# EAGLE design esc (EAGLE 9.5.2)

## Sheet 1 of 2: microcontroller
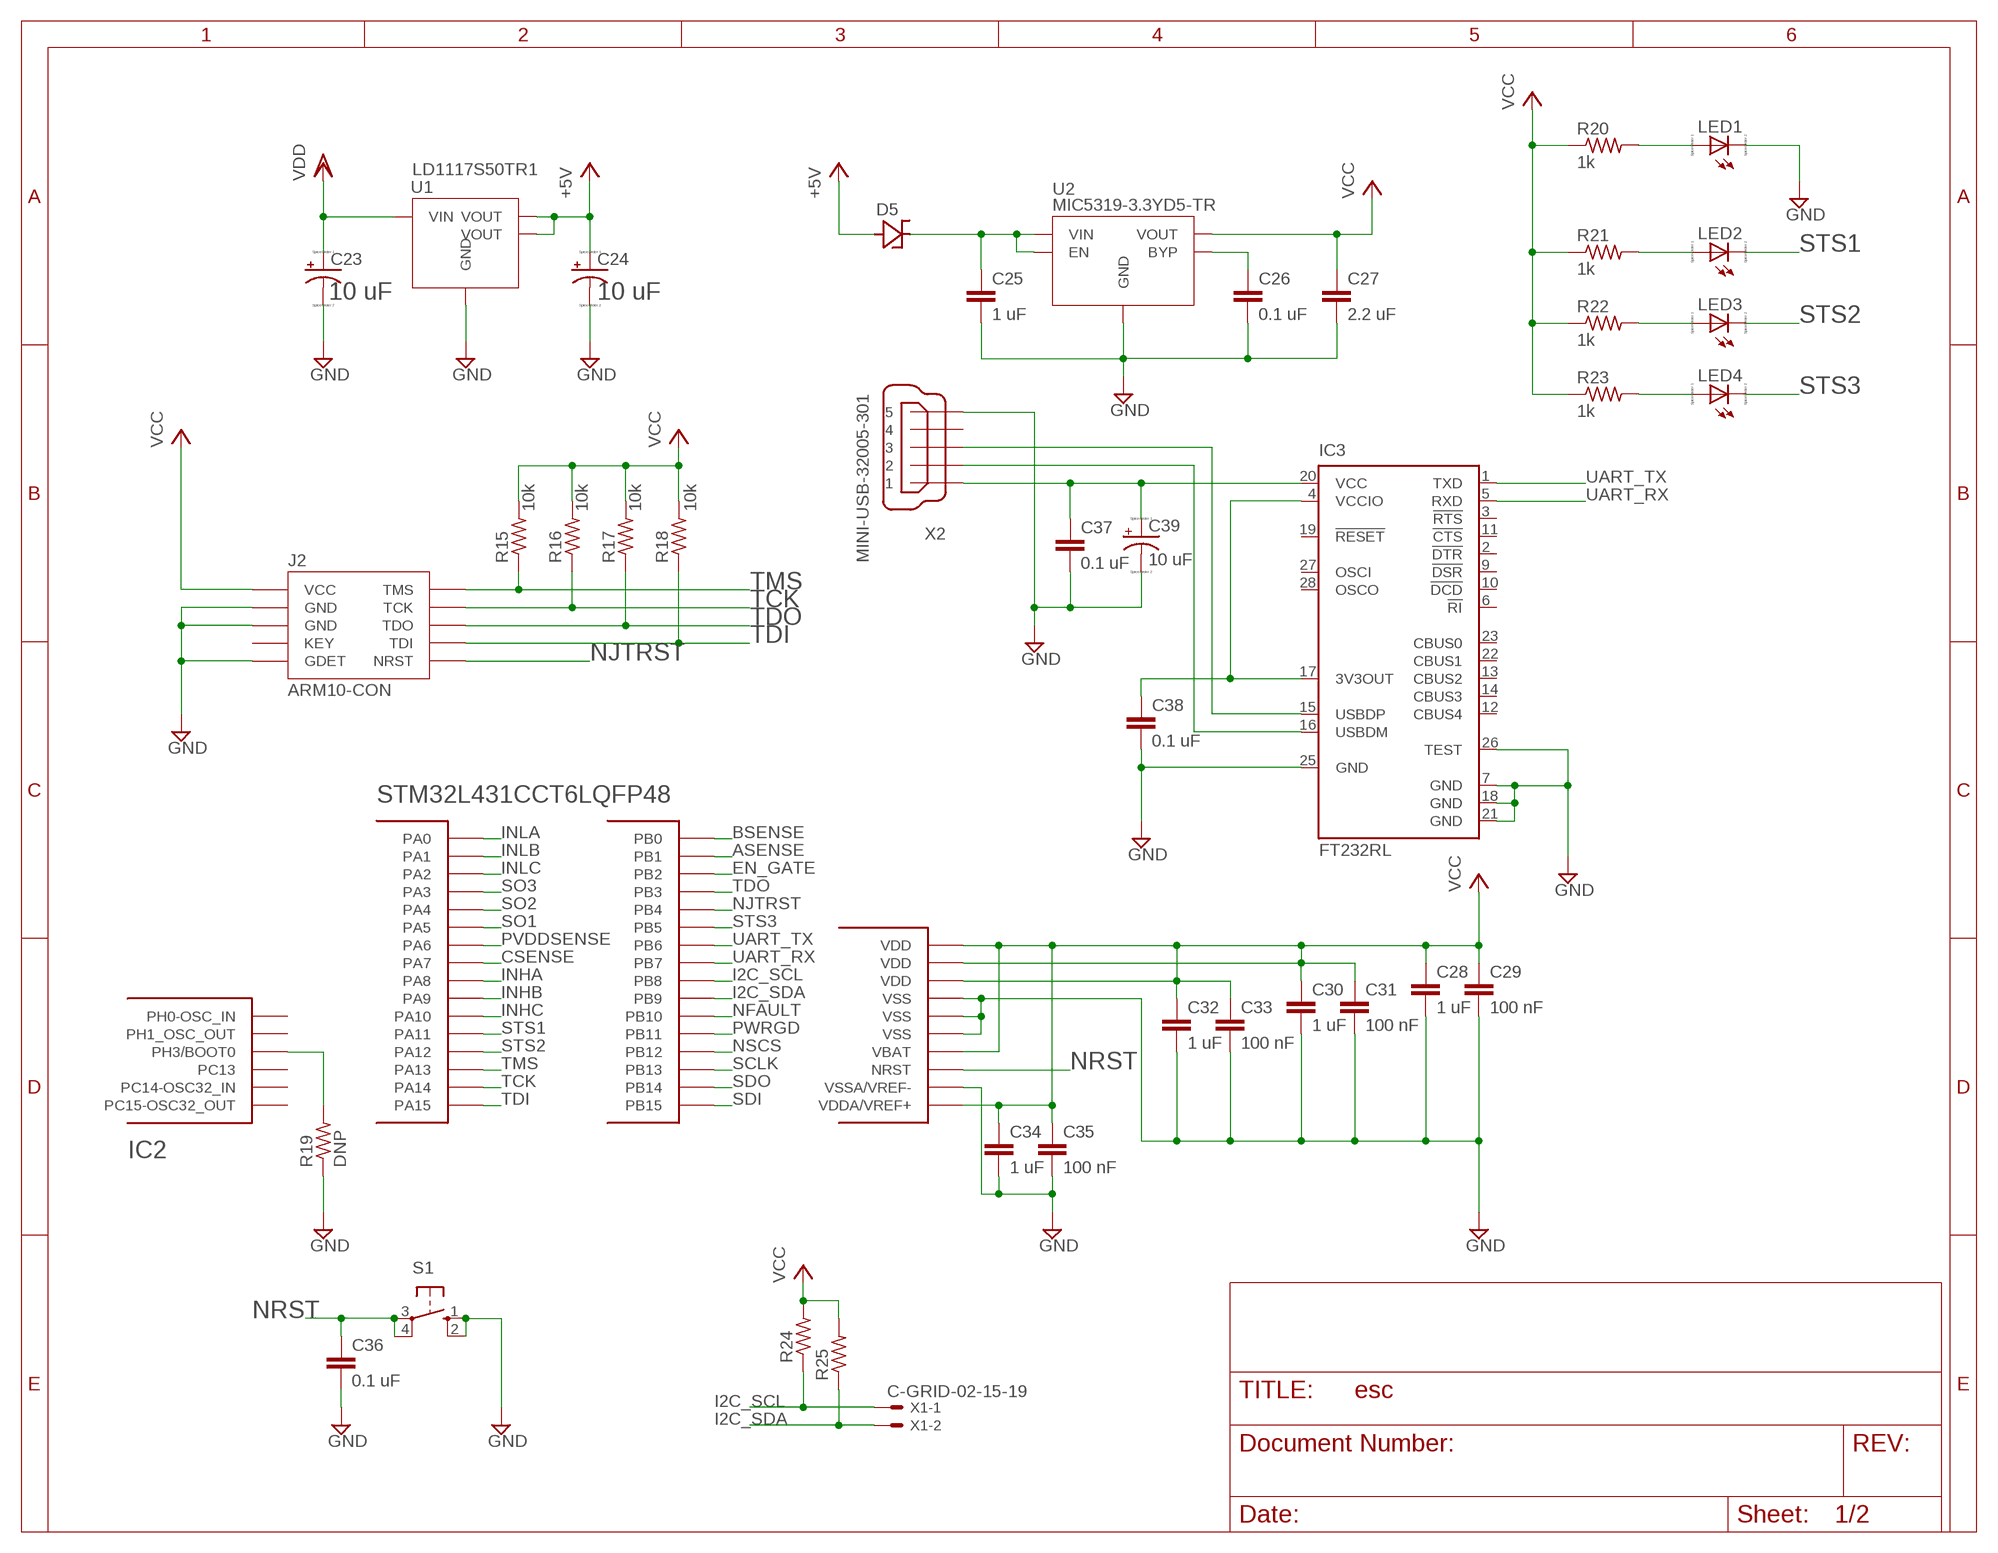
[diagram p0: schematic, sheet 1]

### Parts
C23  10 uF  CAPACITOR4.3X4.3  [CAPAE430X580N]
C24  CAPACITOR4.3X4.3  [CAPAE430X580N]
C25  1 uF  C-EUC0603  [C0603]
C26  0.1 uF  C-EUC0603  [C0603]
C27  2.2 uF  C-EUC0603  [C0603]
C28  1 uF  C-EUC0603  [C0603]
C29  100 nF  C-EUC0603  [C0603]
C30  1 uF  C-EUC0603  [C0603]
C31  100 nF  C-EUC0603  [C0603]
C32  1 uF  C-EUC0603  [C0603]
C33  100 nF  C-EUC0603  [C0603]
C34  1 uF  C-EUC0603  [C0603]
C35  100 nF  C-EUC0603  [C0603]
C36  0.1 uF  C-EUC0603  [C0603]
C37  0.1 uF  C-EUC0603  [C0603]
C38  0.1 uF  C-EUC0603  [C0603]
C39  10 uF  CPOL-USCT3216  [CT3216]
D5  STPS2L30ASMA  [DIOM5025X245N]
IC2  STM32L431CCT6LQFP48  [QFP50P900X900X160-48N]
IC3  FT232RL  [SSOP28]
J2  ARM10-CON  [10-PIN-1.27-PITCH]
LED1  LED_ESML0603  [LED_SML0603]
LED2  LED_ESML0603  [LED_SML0603]
LED3  LED_ESML0603  [LED_SML0603]
LED4  LED_ESML0603  [LED_SML0603]
R15  10k  R-US_R0603  [R0603]
R16  10k  R-US_R0603  [R0603]
R17  10k  R-US_R0603  [R0603]
R18  10k  R-US_R0603  [R0603]
R19  DNP  R-US_R0603  [R0603]
R20  1k  R-US_R0603  [R0603]
R21  1k  R-US_R0603  [R0603]
R22  1k  R-US_R0603  [R0603]
R23  1k  R-US_R0603  [R0603]
R24  R-US_R0603  [R0603]
R25  R-US_R0603  [R0603]
S1  10-XX  [B3F-10XX]
U1  LD1117S50TR1  [SOT230P700X180-4N]
U2  MIC5319-3.3YD5-TR  [SOT95P290X110-5N]
X1  C-GRID-02-15-19  [15-91-02]
X2  MINI-USB-32005-301  [32005-301]

### Nets
+5V: C24.1(+) D5.2(A) U1.2(VOUT) U1.4(VOUT)
ASENSE: IC2.19(PB1) ; also sheet 2
BSENSE: IC2.18(PB0) ; also sheet 2
CSENSE: IC2.17(PA7) ; also sheet 2
EN_GATE: IC2.20(PB2) ; also sheet 2
GND: C23.2(-) C24.2(-) C25.2 C26.2 C27.2 C28.2 C29.2 C30.2 C31.2 C32.2 C33.2 C34.2 C35.2 C36.2 C37.2 C38.2 C39.+(-) IC2.8(VSSA/VREF-) IC2.23(VSS) IC2.35(VSS) IC2.47(VSS) IC3.7(GND) IC3.18(GND) IC3.21(GND) IC3.25(GND) IC3.26(TEST) J2.3(GND) J2.5(GND) J2.9(GDET) LED1.C R19.1 S1.1(S) S1.2(S1) U1.1(GND) U2.2(GND) X2.5 ; also sheet 2
I2C_SCL: IC2.45(PB8) R24.1 X1.1
I2C_SDA: IC2.46(PB9) R25.1 X1.2
INHA: IC2.29(PA8) ; also sheet 2
INHB: IC2.30(PA9) ; also sheet 2
INHC: IC2.31(PA10) ; also sheet 2
INLA: IC2.10(PA0) ; also sheet 2
INLB: IC2.11(PA1) ; also sheet 2
INLC: IC2.12(PA2) ; also sheet 2
N$11: C25.1 D5.1(C) U2.1(VIN) U2.3(EN)
N$12: C26.1 U2.4(BYP)
N$13: IC2.44(PH3/BOOT0) R19.2
N$14: LED1.A R20.2
N$15: C37.1 C39.-(+) IC3.20(VCC) X2.1
N$16: LED2.A R21.2
N$17: LED3.A R22.2
N$18: LED4.A R23.2
N$19: C38.1 IC3.4(VCCIO) IC3.17(3V3OUT)
N$20: IC3.16(USBDM) X2.2
N$21: IC3.15(USBDP) X2.3
NFAULT: IC2.21(PB10) ; also sheet 2
NJTRST: IC2.40(PB4) J2.10(NRST)
NRST: C36.1 IC2.7(NRST) S1.3(P) S1.4(P1)
NSCS: IC2.25(PB12) ; also sheet 2
PVDDSENSE: IC2.16(PA6) ; also sheet 2
PWRGD: IC2.22(PB11) ; also sheet 2
SCLK: IC2.26(PB13) ; also sheet 2
SDI: IC2.28(PB15) ; also sheet 2
SDO: IC2.27(PB14) ; also sheet 2
SO1: IC2.15(PA5) ; also sheet 2
SO2: IC2.14(PA4) ; also sheet 2
SO3: IC2.13(PA3) ; also sheet 2
STS1: IC2.32(PA11) LED2.C
STS2: IC2.33(PA12) LED3.C
STS3: IC2.41(PB5) LED4.C
TCK: IC2.37(PA14) J2.4(TCK) R16.1
TDI: IC2.38(PA15) J2.8(TDI) R18.1
TDO: IC2.39(PB3) J2.6(TDO) R17.1
TMS: IC2.34(PA13) J2.2(TMS) R15.1
UART_RX: IC2.43(PB7) IC3.5(RXD)
UART_TX: IC2.42(PB6) IC3.1(TXD)
VCC: C27.1 C28.1 C29.1 C30.1 C31.1 C32.1 C33.1 C34.1 C35.1 IC2.1(VBAT) IC2.9(VDDA/VREF+) IC2.24(VDD) IC2.36(VDD) IC2.48(VDD) J2.1(VCC) R15.2 R16.2 R17.2 R18.2 R20.1 R21.1 R22.1 R23.1 R24.2 R25.2 U2.5(VOUT) ; also sheet 2
VDD: C23.1(+) U1.3(VIN) ; also sheet 2
Unconnected: IC2.2(PC13) IC2.3(PC14-OSC32_IN) IC2.4(PC15-OSC32_OUT) IC2.5(PH0-OSC_IN) IC2.6(PH1_OSC_OUT) IC3.2(!DTR) IC3.3(!RTS) IC3.6(!RI) IC3.9(!DSR) IC3.10(!DCD) IC3.11(!CTS) IC3.12(CBUS4) IC3.13(CBUS2) IC3.14(CBUS3) IC3.19(!RESET) IC3.22(CBUS1) IC3.23(CBUS0) IC3.27(OSCI) IC3.28(OSCO) J2.7(KEY) X2.4

## Sheet 2 of 2: motor_driver
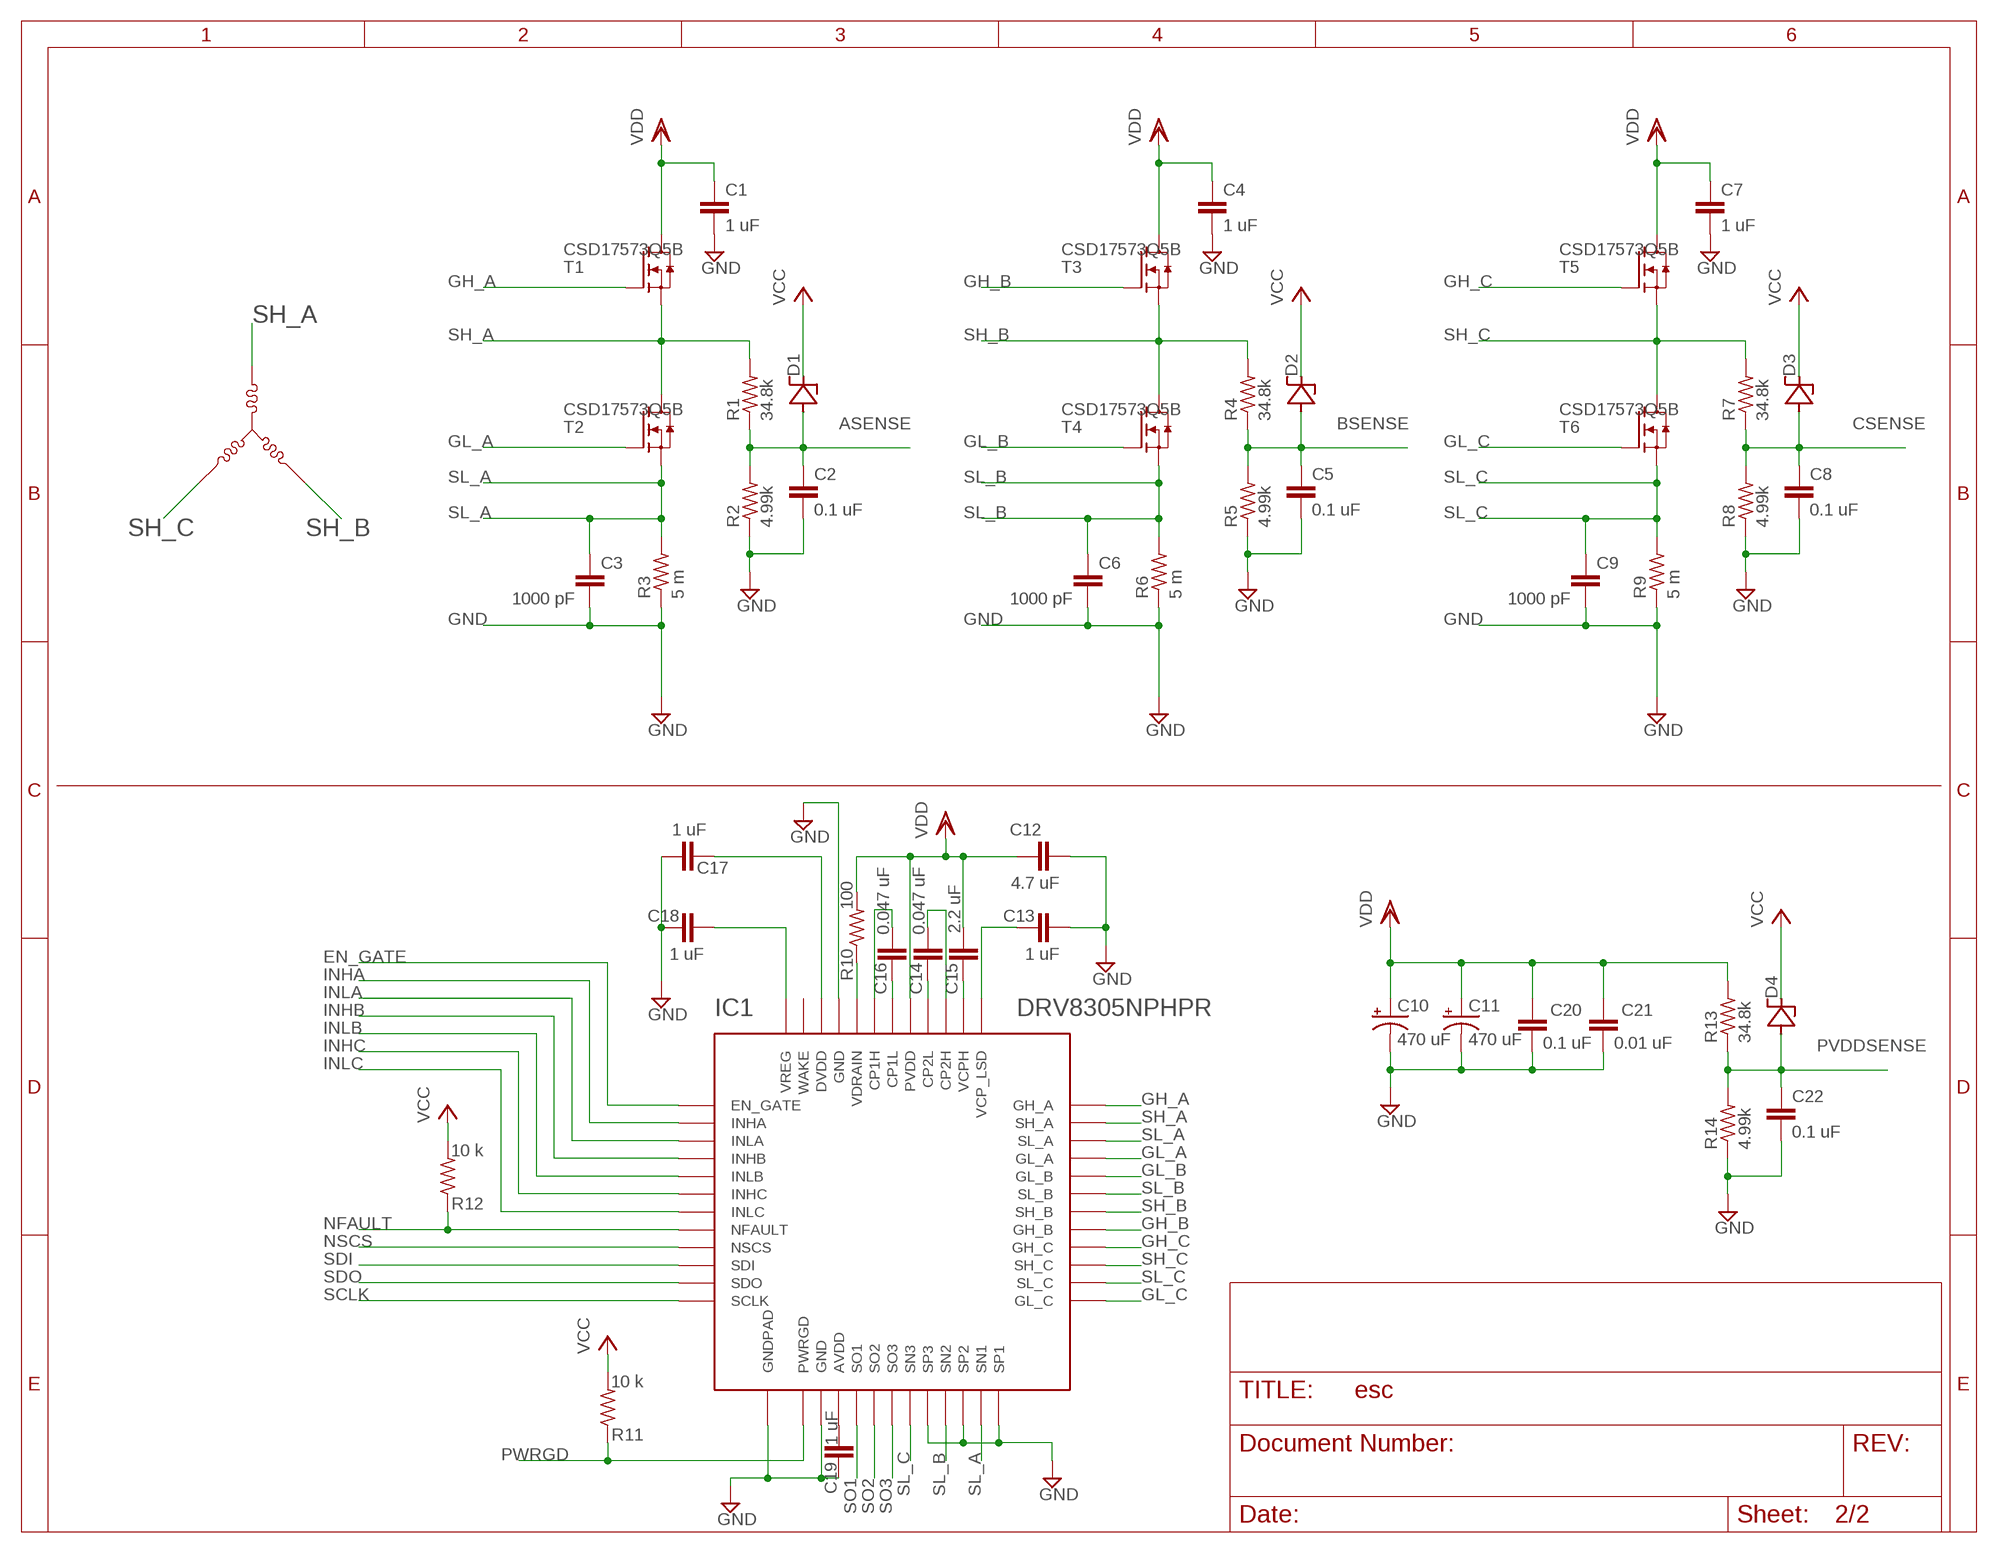
[diagram p1: schematic, sheet 2]

### Parts
C1  1 uF  C-EUC0603  [C0603]
C2  0.1 uF  C-EUC0402  [C0402]
C3  1000 pF  C-EUC0603  [C0603]
C4  1 uF  C-EUC0603  [C0603]
C5  0.1 uF  C-EUC0402  [C0402]
C6  1000 pF  C-EUC0603  [C0603]
C7  1 uF  C-EUC0603  [C0603]
C8  0.1 uF  C-EUC0402  [C0402]
C9  1000 pF  C-EUC0603  [C0603]
C10  470 uF  CPOL-USE5-10.5  [E5-10,5]
C11  470 uF  CPOL-USE5-13  [E5-13]
C12  4.7 uF  C-EUC0805  [C0805]
C13  1 uF  C-EUC0603  [C0603]
C14  0.047 uF  C-EUC0603  [C0603]
C15  2.2 uF  C-EUC0603  [C0603]
C16  0.047 uF  C-EUC0603  [C0603]
C17  1 uF  C-EUC0603  [C0603]
C18  1 uF  C-EUC0603  [C0603]
C19  1 uF  C-EUC0603  [C0603]
C20  0.1 uF  C-EUC0603  [C0603]
C21  0.01 uF  C-EUC0603  [C0603]
C22  0.1 uF  C-EUC0603  [C0603]
D1  STPS2L30ASMA  [DIOM5025X245N]
D2  STPS2L30ASMA  [DIOM5025X245N]
D3  STPS2L30ASMA  [DIOM5025X245N]
D4  STPS2L30ASMA  [DIOM5025X245N]
IC1  DRV8305NPHPR  [48-HTQFP]
R1  34.8k  R-US_R0402  [R0402]
R2  4.99k  R-US_R0402  [R0402]
R3  5 m  R-US_R0603  [R0603]
R4  34.8k  R-US_R0402  [R0402]
R5  4.99k  R-US_R0402  [R0402]
R6  5 m  R-US_R0603  [R0603]
R7  34.8k  R-US_R0402  [R0402]
R8  4.99k  R-US_R0402  [R0402]
R9  5 m  R-US_R0603  [R0603]
R10  100  R-US_R0603  [R0603]
R11  10 k  R-US_R0603  [R0603]
R12  10 k  R-US_R0603  [R0603]
R13  34.8k  R-US_R0603  [R0603]
R14  4.99k  R-US_R0603  [R0603]
T1  CSD17573Q5B  [8-POWERTDFN]
T2  CSD17573Q5B  [8-POWERTDFN]
T3  CSD17573Q5B  [8-POWERTDFN]
T4  CSD17573Q5B  [8-POWERTDFN]
T5  CSD17573Q5B  [8-POWERTDFN]
T6  CSD17573Q5B  [8-POWERTDFN]

### Nets
ASENSE: C2.1 D1.2(A) R1.1 R2.2 ; also sheet 1
BSENSE: C5.1 D2.2(A) R4.1 R5.2 ; also sheet 1
CSENSE: C8.1 D3.2(A) R7.1 R8.2 ; also sheet 1
EN_GATE: IC1.1(EN_GATE) ; also sheet 1
GH_A: IC1.36(GH_A) T1.4(G)
GH_B: IC1.29(GH_B) T3.4(G)
GH_C: IC1.28(GH_C) T5.4(G)
GL_A: IC1.33(GL_A) T2.4(G)
GL_B: IC1.32(GL_B) T4.4(G)
GL_C: IC1.25(GL_C) T6.4(G)
GND: C1.2 C2.2 C3.2 C4.2 C5.2 C6.2 C7.2 C8.2 C9.2 C10.- C11.- C12.2 C13.2 C17.2 C18.1 C19.1 C20.1 C21.1 C22.2 IC1.14(GND) IC1.20(SP3) IC1.22(SP2) IC1.24(SP1) IC1.45(GND) IC1.49(GNDPAD) R2.1 R3.1 R5.1 R6.1 R8.1 R9.1 R14.1 ; also sheet 1
INHA: IC1.2(INHA) ; also sheet 1
INHB: IC1.4(INHB) ; also sheet 1
INHC: IC1.6(INHC) ; also sheet 1
INLA: IC1.3(INLA) ; also sheet 1
INLB: IC1.5(INLB) ; also sheet 1
INLC: IC1.7(INLC) ; also sheet 1
N$1: C13.1 IC1.37(VCP_LSD)
N$2: C16.1 IC1.42(CP1L)
N$3: C14.2 IC1.39(CP2H)
N$4: C14.1 IC1.40(CP2L)
N$5: C15.1 IC1.38(VCPH)
N$6: C16.2 IC1.43(CP1H)
N$7: C18.2 IC1.48(VREG)
N$8: IC1.44(VDRAIN) R10.1
N$9: C17.1 IC1.46(DVDD)
N$10: C19.2 IC1.15(AVDD)
NFAULT: IC1.8(NFAULT) R12.1 ; also sheet 1
NSCS: IC1.9(NSCS) ; also sheet 1
PVDDSENSE: C22.1 D4.2(A) R13.1 R14.2 ; also sheet 1
PWRGD: IC1.13(PWRGD) R11.1 ; also sheet 1
SCLK: IC1.12(SCLK) ; also sheet 1
SDI: IC1.10(SDI) ; also sheet 1
SDO: IC1.11(SDO) ; also sheet 1
SH_A: IC1.35(SH_A) R1.2 T1.1(S) T1.2(S) T1.3(S) T2.5(D)
SH_B: IC1.30(SH_B) R4.2 T3.1(S) T3.2(S) T3.3(S) T4.5(D)
SH_C: IC1.27(SH_C) R7.2 T5.1(S) T5.2(S) T5.3(S) T6.5(D)
SL_A: C3.1 IC1.23(SN1) IC1.34(SL_A) R3.2 T2.1(S) T2.2(S) T2.3(S)
SL_B: C6.1 IC1.21(SN2) IC1.31(SL_B) R6.2 T4.1(S) T4.2(S) T4.3(S)
SL_C: C9.1 IC1.19(SN3) IC1.26(SL_C) R9.2 T6.1(S) T6.2(S) T6.3(S)
SO1: IC1.16(SO1) ; also sheet 1
SO2: IC1.17(SO2) ; also sheet 1
SO3: IC1.18(SO3) ; also sheet 1
VCC: D1.1(C) D2.1(C) D3.1(C) D4.1(C) R11.2 R12.2 ; also sheet 1
VDD: C1.1 C4.1 C7.1 C10.+ C11.+ C12.1 C15.2 C20.2 C21.2 IC1.41(PVDD) R10.2 R13.2 T1.5(D) T3.5(D) T5.5(D) ; also sheet 1
Unconnected: IC1.47(WAKE)

## Library data of the parts
C1-C9 C12-C22 C25-C38 = resistor:C-EU: CAPACITOR, European symbol
C10 C11 = rcl:CPOL-US: POLARIZED CAPACITOR, American symbol; SPICEPREFIX: C
C23 C24 = qc_esc:CAPACITOR; VAL: 10 uF
C39 = resistor:CPOL-US: POLARIZED CAPACITOR, American symbol
D1-D5 = qc_esc:STPS2L30A
IC1 = qc_esc:DRV8305NPHPR
IC2 = qc_esc:STM32L431CCT6
IC3 = ftdichip:FT232R: Source: http://www.ftdichip.com/Documents/DataSheets/DS_FT232R_v104.pdf; MPN: FT232RL; OC_FARNELL: 1146032; OC_NEWARK: 91K9918
J2 = qc_esc:ARM10-CON
LED1-LED4 = eagle-ltspice:LED_E: LED Source: http://www.osram.convergy.de Source: www.luxeon.com Source: www.kingbright.com; SPICEMODEL: NONE; SPICEPREFIX: D; SPICETYPE: diode
R1-R25 = resistor:R-US_: RESISTOR, American symbol
S1 = switch-omron:10-XX: OMRON SWITCH; MPN: B3F-1000; OC_FARNELL: 176432; OC_NEWARK: 36M3542
T1-T6 = qc_esc:CSD17573Q5B
U1 = qc_esc:LD1117S50TR
U2 = qc_esc:MIC5319
X1 = con-molex:C-GRID-02: CONNECTOR wire to board 2.54 mm (0.100") pitch header; MF: MOLEX; OC_FARNELL: unknown; OC_NEWARK: unknown
X2 = con-cypressindustries:MINI-USB-: MINI USB-B Conector Source: www.cypressindustries.com; OC_FARNELL: unknown; OC_NEWARK: unknown

## Module 2
Ports: 1(io)

### Library data of the parts

## Board
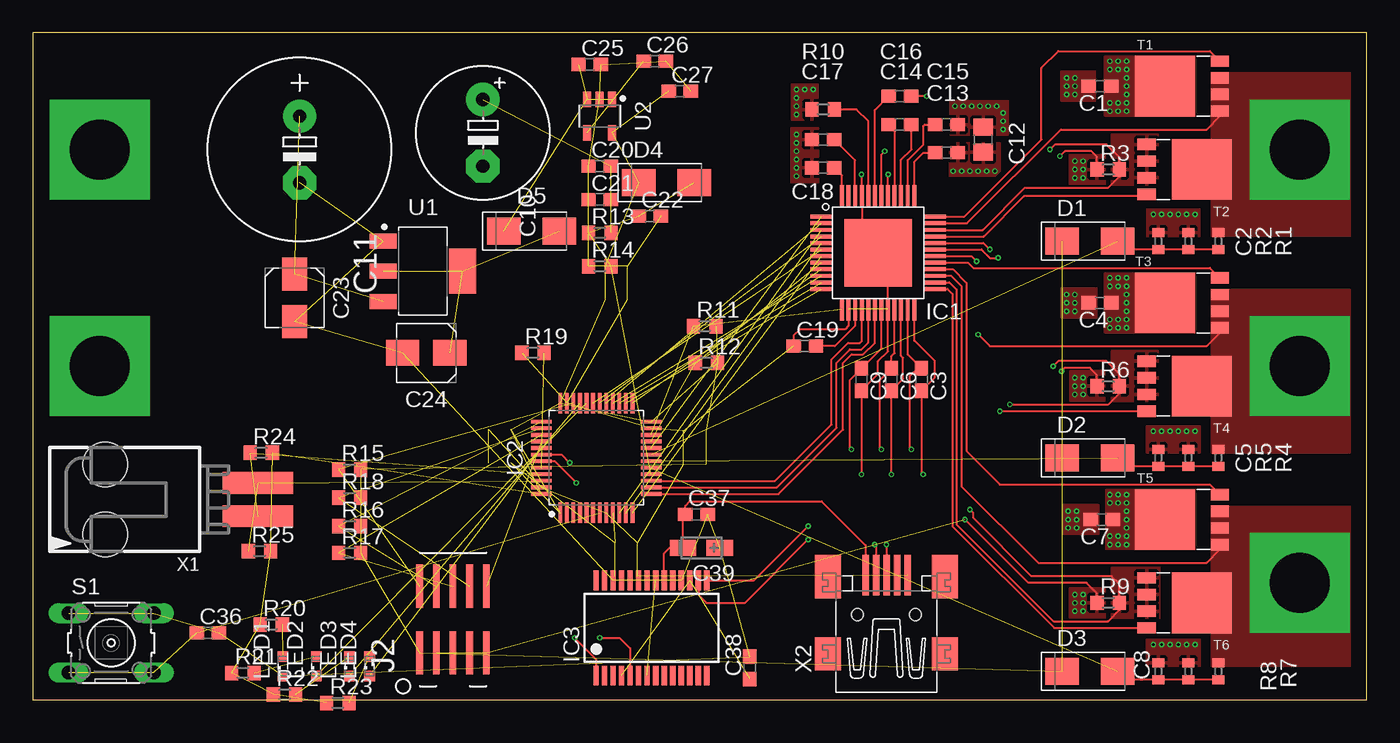
[diagram p2: board, top side]
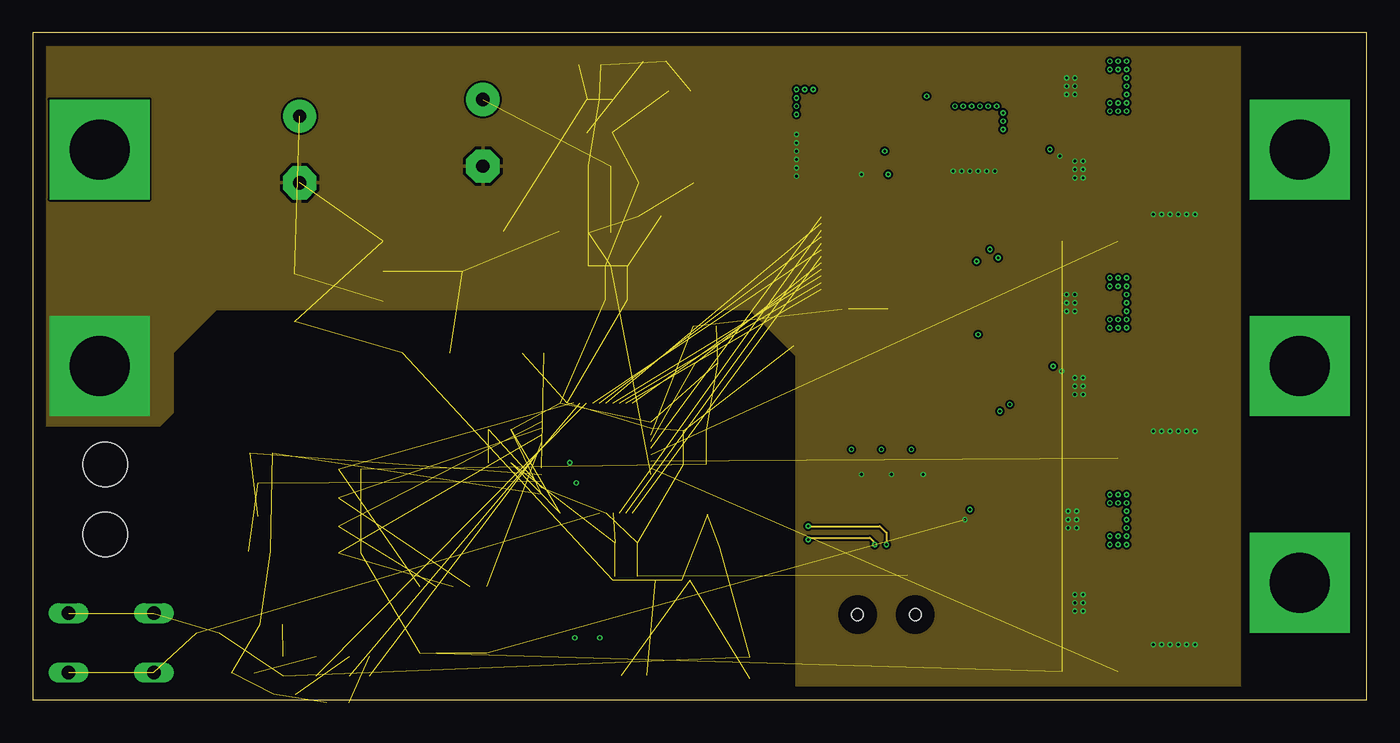
[diagram p3: board, inner layer Route2]
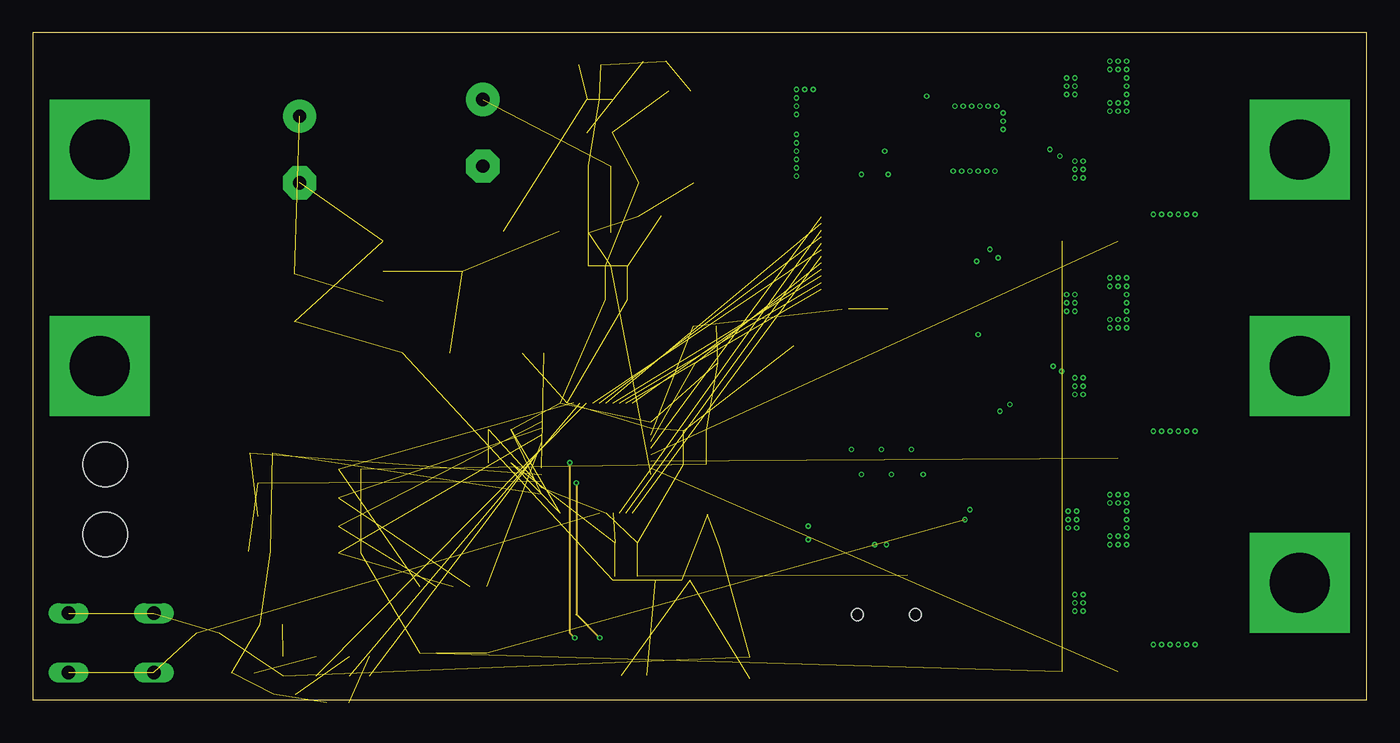
[diagram p4: board, inner layer Route15]
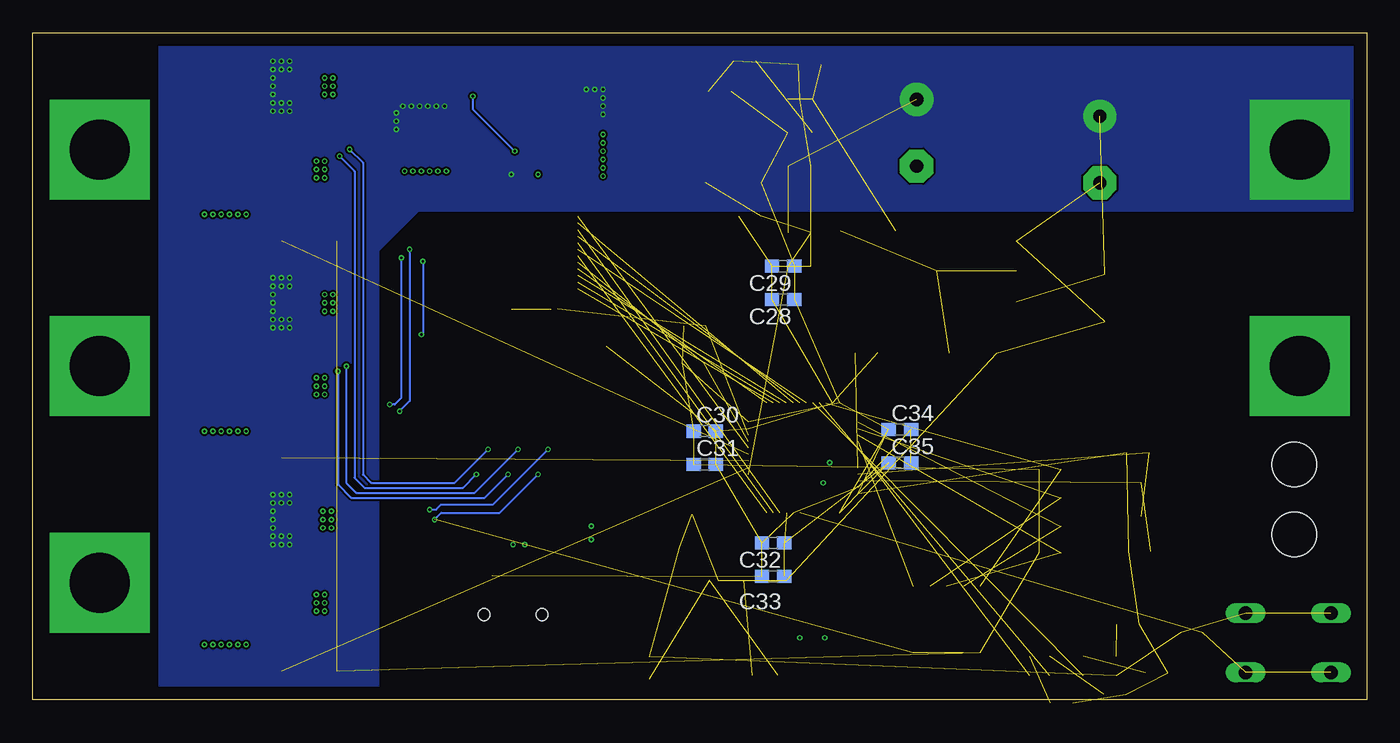
[diagram p5: board, bottom side, seen from below]

Size 101.6 x 50.8 mm. Coordinates in mm from the lower left corner, seen from the top.
Outline: 0,0 101.6,0 101.6,50.8 0,50.79 0,0
Copper layers (1+2*15+16): Top 0.035mm / dielectric 1.5mm / Route2 0.035mm / dielectric 0.15mm / Route15 0.035mm / dielectric 0.2mm / Bottom 0.035mm
Design rules "default *": minimum track width 6mil, minimum drill 0.2mm, track to track 6mil, track to pad 6mil, pad to pad 6mil, via to via 6mil, smd to smd 6mil, copper to edge 40mil, drill to drill 6mil, minimum pad ring 10mil, minimum via ring 4mil, stop-mask expansion 4mil, vias tented up to drill 0mil, thermal gap 10mil

### Footprints (pad centres in the part's own frame; a part is rotated, then mirrored left to right if it is on the bottom)
C0603 = smd 1.1 x 1: 1 -0.85,0; 2 0.85,0
C0402 = smd 0.7 x 0.9: 1 -0.65,0; 2 0.65,0
E5-10,5 = drill 1.016 pad 2.54: + -2.54,0 | drill 1.016 pad 2.54 octagon: - 2.54,0
E5-13 = drill 1.016 pad 2.54: + -2.54,0 | drill 1.016 pad 2.54 octagon: - 2.54,0
C0805 = smd 1.3 x 1.5: 1 -0.95,0; 2 0.95,0
CAPAE430X580N = smd 2.524 x 1.915: 1 -1.798,0; 2 1.798,0
CT3216 = smd 2 x 1.2: + -1.4,0; - 1.4,0
DIOM5025X245N = smd 2.547 x 2.05: 1 -2.114,0; 2 2.114,0
48-HTQFP = smd 0.3 x 1.7: 1 -2.75,-4.3; 2 -2.25,-4.3; 3 -1.75,-4.3; 4 -1.25,-4.3; 5 -0.75,-4.3; 6 -0.25,-4.3; 7 0.25,-4.3; 8 0.75,-4.3; 9 1.25,-4.3; 10 1.75,-4.3; 11 2.25,-4.3; 12 2.75,-4.3; 25 2.75,4.3; 26 2.25,4.3; 27 1.75,4.3; 28 1.25,4.3; 29 0.75,4.3; 30 0.25,4.3; 31 -0.25,4.3; 32 -0.75,4.3; 33 -1.25,4.3; 34 -1.75,4.3; 35 -2.25,4.3; 36 -2.75,4.3 | smd 1.7 x 0.3: 13 4.3,-2.75; 14 4.3,-2.25; 15 4.3,-1.75; 16 4.3,-1.25; 17 4.3,-0.75; 18 4.3,-0.25; 19 4.3,0.25; 20 4.3,0.75; 21 4.3,1.25; 22 4.3,1.75; 23 4.3,2.25; 24 4.3,2.75; 37 -4.3,2.75; 38 -4.3,2.25; 39 -4.3,1.75; 40 -4.3,1.25; 41 -4.3,0.75; 42 -4.3,0.25; 43 -4.3,-0.25; 44 -4.3,-0.75; 45 -4.3,-1.25; 46 -4.3,-1.75; 47 -4.3,-2.25; 48 -4.3,-2.75 | smd 5.17 x 5.17: 49 0,0
QFP50P900X900X160-48N = smd 1.559 x 0.28: 1 -4.178,2.75; 2 -4.178,2.25; 3 -4.178,1.75; 4 -4.178,1.25; 5 -4.178,0.75; 6 -4.178,0.25; 7 -4.178,-0.25; 8 -4.178,-0.75; 9 -4.178,-1.25; 10 -4.178,-1.75; 11 -4.178,-2.25; 12 -4.178,-2.75; 25 4.178,-2.75; 26 4.178,-2.25; 27 4.178,-1.75; 28 4.178,-1.25; 29 4.178,-0.75; 30 4.178,-0.25; 31 4.178,0.25; 32 4.178,0.75; 33 4.178,1.25; 34 4.178,1.75; 35 4.178,2.25; 36 4.178,2.75 | smd 0.28 x 1.559: 13 -2.75,-4.178; 14 -2.25,-4.178; 15 -1.75,-4.178; 16 -1.25,-4.178; 17 -0.75,-4.178; 18 -0.25,-4.178; 19 0.25,-4.178; 20 0.75,-4.178; 21 1.25,-4.178; 22 1.75,-4.178; 23 2.25,-4.178; 24 2.75,-4.178; 37 2.75,4.178; 38 2.25,4.178; 39 1.75,4.178; 40 1.25,4.178; 41 0.75,4.178; 42 0.25,4.178; 43 -0.25,4.178; 44 -0.75,4.178; 45 -1.25,4.178; 46 -1.75,4.178; 47 -2.25,4.178; 48 -2.75,4.178
SSOP28 = smd 0.4 x 1.5: 1 -4.225,-3.625; 2 -3.575,-3.625; 3 -2.925,-3.625; 4 -2.275,-3.625; 5 -1.625,-3.625; 6 -0.975,-3.625; 7 -0.325,-3.625; 8 0.325,-3.625; 9 0.975,-3.625; 10 1.625,-3.625; 11 2.275,-3.625; 12 2.925,-3.625; 13 3.575,-3.625; 14 4.225,-3.625; 15 4.225,3.625; 16 3.575,3.625; 17 2.925,3.625; 18 2.275,3.625; 19 1.625,3.625; 20 0.975,3.625; 21 0.325,3.625; 22 -0.325,3.625; 23 -0.975,3.625; 24 -1.625,3.625; 25 -2.275,3.625; 26 -2.925,3.625; 27 -3.575,3.625; 28 -4.225,3.625
10-PIN-1.27-PITCH = smd 0.508 x 3.302: 1 -2.54,-2.54; 2 -2.54,2.54; 3 -1.27,-2.54; 4 -1.27,2.54; 5 0,-2.54; 6 0,2.54; 7 1.27,-2.54; 8 1.27,2.54; 9 2.54,-2.54; 10 2.54,2.54
LED_SML0603 = smd 0.8 x 0.8: A 0.75,0; C -0.75,0
R0402 = smd 0.7 x 0.9: 1 -0.65,0; 2 0.65,0
R0603 = smd 1 x 1.1: 1 -0.85,0; 2 0.85,0
B3F-10XX = drill 1.016 long: 1 -3.251,2.261; 2 3.251,2.261; 3 -3.251,-2.261; 4 3.251,-2.261
8-POWERTDFN = smd 1.372 x 0.864: 1 2.794,-1.905; 2 2.794,-0.635; 3 2.794,0.635; 4 2.794,1.905 | smd 4.572 x 4.623: 5 -1.397,0
SOT230P700X180-4N = smd 2.069 x 1.142: 1 -3.03,2.3; 2 -3.03,0; 3 -3.03,-2.3 | smd 2.069 x 3.418: 4 3.03,0
SOT95P290X110-5N = smd 1.18 x 0.609: 1 -1.274,0.95; 2 -1.274,0; 3 -1.274,-0.95; 4 1.274,-0.95; 5 1.274,0.95
15-91-02 = smd 1.651 x 5.334: 1 -1.27,-10.795; 2 1.27,-10.795 | hole 3.404: -2.667,0.838; 2.667,0.838
32005-301 = smd 3.1 x 0.5: 1 3,1.6; 2 3,0.8; 3 3,0; 4 3,-0.8; 5 3,-1.6 | smd 2.5 x 2: M1 -3,-4.45; M2 -3,4.45 | smd 3.3 x 2: M3 2.9,4.45; M4 2.9,-4.45 | hole 0.9: 0,2.2; 0,-2.2

### Placement (x,y rotation side)
C1  81.28,46.74 180 top
C2  85.72,34.92 90 top
C3  67.69,24.38 270 top
C4  81.28,30.23 180 top
C5  85.72,18.41 90 top
C6  65.41,24.38 270 top
C7  81.41,13.72 180 top
C8  85.72,2.16 90 top
C9  63.12,24.38 270 top
C10  34.29,43.18 270 top
C11  20.32,41.91 270 top
C12  72.39,42.67 270 top
C13  69.6,41.66 0 top
C14  66.04,43.81 0 top
C15  69.6,43.81 0 top
C16  66.04,45.97 180 top
C17  60.2,42.67 180 top
C18  60.2,40.51 0 top
C19  58.8,26.92 0 top
C20  43.18,40.64 0 top
C21  43.18,38.1 0 top
C22  46.99,36.83 0 top
C23  19.94,30.61 270 top
C24  29.97,26.42 180 top
C25  42.42,48.39 0 top
C26  47.37,48.64 0 top
C27  49.28,46.35 0 top
C28  44.45,30.48 180 bottom
C29  44.45,33.02 180 bottom
C30  50.42,20.45 0 bottom
C31  50.42,17.91 0 bottom
C32  45.21,11.94 180 bottom
C33  45.21,9.4 180 bottom
C34  35.56,20.57 0 bottom
C35  35.56,18.03 0 bottom
C36  13.34,5.08 0 top
C37  50.55,14.1 0 top
C38  54.61,2.41 90 top
C39  50.93,11.56 180 top
D1  80.52,34.92 0 top
D2  80.52,18.41 0 top
D3  80.52,2.16 0 top
D4  48.26,39.37 0 top
D5  37.97,35.69 0 top
IC1  64.39,34.04 270 top
IC2  42.93,18.41 90 top
IC3  47.12,5.46 0 top
J2  32,6.1 0 top
LED1  19.05,2.54 90 top
LED2  21.59,2.54 90 top
LED3  24.13,2.54 90 top
LED4  25.65,2.54 90 top
R1  90.3,34.92 90 top
R2  88.01,34.92 270 top
R3  81.92,40.39 0 top
R4  90.3,18.41 90 top
R5  88.01,18.41 270 top
R6  81.92,23.88 0 top
R7  90.3,2.16 90 top
R8  88.01,2.16 270 top
R9  81.92,7.37 0 top
R10  60.2,44.96 180 top
R11  51.18,28.45 0 top
R12  51.31,25.65 0 top
R13  43.18,35.56 0 top
R14  43.18,33.02 0 top
R15  24.13,17.53 0 top
R16  24.13,13.21 0 top
R17  24.13,11.18 0 top
R18  24.13,15.37 0 top
R19  38.1,26.42 0 top
R20  18.16,5.71 0 top
R21  16,2.03 0 top
R22  19.18,0.38 0 top
R23  23.24,-0.25 0 top
R24  17.4,18.8 0 top
R25  17.27,11.3 0 top
S1  5.97,4.32 0 top
T1  87.63,46.74 0 top
T2  87.63,40.39 180 top
T3  87.63,30.23 0 top
T4  87.63,23.88 180 top
T5  87.63,13.72 0 top
T6  87.63,7.37 180 top
U1  29.72,32.64 0 top
U2  43.18,44.45 270 top
X1  6.35,15.24 90 top
X2  65.02,6.48 90 top

### Tracks (layer width: path | path; a pad name or v marks a point on that pad's centre or on a via)
+5V  (3 unrouted)
ASENSE  (1 unrouted)
  Top 0.152: R1.1 R2.2 C2.1 83.28,34.27 D1.2
BSENSE  (1 unrouted)
  Top 0.152: R4.1 R5.2 C5.1 83.28,17.77 D2.2
CSENSE  (1 unrouted)
  Top 0.152: R7.1 R8.2 C8.1 83.28,1.51 D3.2
EN_GATE  (1 unrouted)
GH_A
  Top 0.152: T1.4 89.66,49.4 78.11,49.4 76.83,48.13 76.83,42.67 70.95,36.79 IC1.36
GH_B
  Top 0.152: IC1.29 71.23,33.29 71.63,32.89 89.66,32.89 T3.4
GH_C
  Top 0.152: IC1.28 70.08,32.79 71.12,31.75 71.12,18.92 73.66,16.38 89.66,16.38 T5.4
GL_A
  Top 0.152: IC1.33 72.43,35.29 75.5,38.35 84.71,38.35 T2.4
GL_B  (via drill 0.2)
  Top 0.152: IC1.32 72.4,34.79 v72.9,34.29 | v73.66,21.97 T4.4
  Bottom 0.152: v72.9,34.29 72.9,22.73 v73.66,21.97
GL_C
  Top 0.152: IC1.25 69.68,31.29 70.05,30.91 70.05,13.21 77.8,5.46 T6.4
GND  (via drill 0.2, 4.57 pad 7.62)  (41 unrouted)
  Top 0.152: R3.1 81.06,41.36 80.64,41.78 78.61,41.78 v78.23,41.4 | R6.1 81.06,24.73 80.52,25.27 78.61,25.27 v78.36,25.02 | R9.1 81.06,8.09 80.26,8.89 75.82,8.89 v70.99,13.72 | v63.12,40.01 63.14,39.98 IC1.45 63.14,35.29 IC1.49 65.14,33.29 IC1.20 65.14,26.53 64.39,25.78 64.39,24.8 C9.2 v63.12,17.14 | v67.82,17.14 67.69,17.27 C3.2 68.71,24.55 68.71,25.78 67.14,27.35 IC1.24 | IC1.22 66.14,26.19 66.29,26.04 66.29,24.42 C6.2 v65.41,17.14 | IC1.14 62.14,28.48 61.85,28.19 58.42,28.19 57.95,27.73 C19.1
  Bottom 0.152: v78.36,25.02 78.36,16.38 77.34,15.37 67.18,15.37 v65.41,17.14 | v78.23,41.4 77.09,40.26 77.09,16.89 76.33,16.13 68.83,16.13 v67.82,17.14 | v70.99,13.72 70.48,14.22 66.04,14.22 v63.12,17.14
  other vias: 5.08,25.4 80.01,41.02 79.38,41.02 79.38,40.39 80.01,40.39 80.01,39.75 79.38,39.75 80.01,24.51 79.38,24.51 79.38,23.88 80.01,23.88 80.01,23.24 79.38,23.24 80.01,8 79.38,8 79.38,7.37 80.01,7.37 80.01,6.73 79.38,6.73 79.38,47.37 78.74,47.37 78.74,46.74 79.38,46.74 79.38,46.1 78.74,46.1 79.38,30.86 78.74,30.86 78.74,30.23 79.38,30.23 79.38,29.59 78.74,29.59 79.5,14.35 78.87,14.35 78.87,13.72 79.5,13.72 79.5,13.08 78.87,13.08 85.34,36.96 85.98,36.96 86.61,36.96 87.25,36.96 87.88,36.96 88.52,36.96 85.34,20.45 85.98,20.45 86.61,20.45 87.25,20.45 87.88,20.45 85.34,4.19 85.98,4.19 86.61,4.19 87.25,4.19 87.88,4.19 88.52,4.19 88.52,20.45 58.17,43.05 58.17,42.42 58.17,41.78 58.17,41.15 58.17,40.51 58.17,39.88 70.1,40.26 70.74,40.26 71.37,40.26 72.01,40.26 72.64,40.26 73.28,40.26
  pour Route2: 0,50.8 91.95,50.8 91.95,0 58.17,0 58.17,26.16 54.61,29.72 13.97,29.72 10.67,26.42 10.67,21.84 9.65,20.83 0,20.83
  pour Top: 78.99,41.53 81.66,41.53 81.66,39.24 78.99,39.24
  pour Top: 81.66,25.02 78.99,25.02 78.99,22.73 81.66,22.73
  pour Top: 78.99,8.51 81.66,8.51 81.66,6.22 78.99,6.22
  pour Top (no thermals): 78.36,47.88 80.9,47.88 80.9,45.59 78.36,45.59
  pour Top (no thermals): 78.36,31.37 81.03,31.37 81.03,29.08 78.36,29.08
  pour Top (no thermals): 78.49,14.86 81.15,14.86 81.15,12.57 78.49,12.57
  pour Top: 84.84,35.31 88.9,35.31 88.9,37.34 84.84,37.34
  pour Top: 84.84,20.83 88.9,20.83 88.9,18.8 84.84,18.8
  pour Top: 84.84,4.57 88.9,4.57 88.9,2.54 84.84,2.54
  pour Top: 57.78,43.56 59.82,43.56 59.82,39.37 57.78,39.37
  pour Top: 73.15,42.42 73.53,42.42 73.66,42.42 73.66,40.26 73.53,40.13 73.28,39.88 69.85,39.88 69.85,42.42
I2C_SCL  (2 unrouted)
I2C_SDA  (2 unrouted)
INHA  (1 unrouted)
INHB  (1 unrouted)
INHC  (1 unrouted)
INLA  (1 unrouted)
INLB  (1 unrouted)
INLC  (1 unrouted)
N$1
  Top 0.152: C13.1 68.75,41.57 68.66,41.66 67.82,41.66 67.14,40.98 IC1.37
N$2  (via drill 0.2)
  Top 0.152: IC1.42 64.64,41.52 v64.9,41.78 | v68.07,45.97 C16.1
  Bottom 0.152: v64.9,41.78 68.07,44.96 v68.07,45.97
N$3
  Top 0.152: IC1.39 66.14,41.12 66.93,41.91 66.93,43.78 C14.2
N$4
  Top 0.152: C14.1 65.64,43.37 IC1.40
N$5
  Top 0.152: IC1.38 66.64,41.11 67.82,42.29 67.82,43.69 67.94,43.81 C15.1
N$6
  Top 0.152: IC1.43 64.14,44.92 C16.2
N$7
  Top 0.152: IC1.48 61.64,39.92 C18.2
N$8
  Top 0.152: IC1.44 63.64,44.06 62.74,44.96 R10.1
N$9
  Top 0.152: IC1.46 62.64,41.08 C17.1
N$10
  Top 0.152: IC1.15 62.64,28.48 61.09,26.92 C19.2
N$11  (3 unrouted)
N$12  (1 unrouted)
N$13  (1 unrouted)
N$14  (1 unrouted)
N$15
  Top 0.152: IC3.20 48.09,11.13 48.51,11.56 C39.- 49.53,13.93 C37.1 49.7,14.77 50.04,15.11 60.07,15.11 63.42,11.76 X2.1
N$16  (1 unrouted)
N$17  (1 unrouted)
N$18  (1 unrouted)
N$19  (2 unrouted)
N$20  (via drill 0.2)
  Top 0.152: IC3.16 50.69,7.98 51.31,7.37 54.23,7.37 v59.05,12.19 | v64.14,11.81 64.22,11.72 X2.2
  Route2 0.152: v59.05,12.19 59.18,12.32 63.75,12.32 64.14,11.94 v64.14,11.81
N$21  (via drill 0.2)
  Top 0.152: IC3.15 54.93,9.09 v59.05,13.21 | v65.02,11.81 X2.3 65.02,8.89
  Route2 0.152: v59.05,13.21 64.52,13.21 65.02,12.7 v65.02,11.81
NFAULT  (2 unrouted)
NJTRST  (1 unrouted)
NRST  (3 unrouted)
NSCS  (1 unrouted)
PVDDSENSE  (4 unrouted)
PWRGD  (2 unrouted)
SCLK  (1 unrouted)
SDI  (1 unrouted)
SDO  (1 unrouted)
SH_A  (via drill 4.57 pad 7.62)
  Top 0.152: IC1.35 71.16,36.29 78.31,43.43 89.41,43.43 90.42,44.45 T1.1
  other vias: 96.52,41.91
  pour Top (no thermals): 89.79,47.75 100.33,47.75 100.33,35.31 89.79,35.31
SH_B  (via drill 0.2, 4.57 pad 7.62)
  Top 0.152: IC1.30 71.5,33.79 v71.88,33.4 | v72.01,27.81 72.9,26.92 89.41,26.92 90.42,27.94 T3.1
  Bottom 0.152: v71.88,33.4 71.88,27.94 v72.01,27.81
  other vias: 96.52,25.4
  pour Top (no thermals): 89.79,31.24 100.33,31.24 100.33,18.8 89.79,18.8
SH_C  (via drill 4.57 pad 7.62)
  Top 0.152: IC1.27 69.95,32.29 70.74,31.5 70.74,16.26 76.58,10.41 89.41,10.41 90.42,11.43 T5.1
  other vias: 96.52,8.89
  pour Top (no thermals): 89.79,14.73 100.33,14.73 100.33,2.54 89.79,2.54
SL_A  (via drill 0.2)
  Top 0.152: IC1.34 72.36,35.79 75.56,38.99 81.92,38.99 82.77,39.84 R3.2 82.77,41.31 81.79,42.29 77.85,42.29 v77.47,41.91 | v66.93,19.05 66.8,19.18 66.8,24.64 67.4,25.23 C3.1 66.64,26.29 IC1.23
  Bottom 0.152: v77.47,41.91 76.45,40.89 76.45,17.14 75.82,16.51 69.47,16.51 v66.93,19.05
  pour Top: 82.17,43.05 82.17,39.24 85.72,39.24 85.72,43.05
SL_B  (via drill 0.2)
  Top 0.152: IC1.31 72.27,34.29 72.9,33.66 v73.53,33.66 | v74.42,22.48 81.92,22.48 82.77,23.33 R6.2 82.77,24.8 81.79,25.78 78.11,25.78 v77.72,25.4 | C6.1 65.64,25.47 | C6.1 65.41,26.16 65.64,26.4 IC1.21 | v64.64,19.05 64.52,19.18 64.52,24.34 C6.1
  Bottom 0.152: v73.53,33.66 73.53,22.99 74.04,22.48 v74.42,22.48 | v77.72,25.4 77.72,16.51 76.96,15.75 67.94,15.75 v64.64,19.05
  pour Top: 82.17,26.54 82.17,22.73 85.72,22.73 85.72,26.54
SL_C  (via drill 0.2)
  Top 0.152: IC1.26 69.81,31.79 70.36,31.24 70.36,13.34 77.72,5.97 81.92,5.97 82.77,6.82 R9.2 82.77,8.8 82.17,9.4 76.07,9.4 71.63,13.84 71.63,14.22 v71.37,14.48 | IC1.19 64.64,26.75 C9.1 62.23,24.34 62.23,19.18 v62.36,19.05
  Bottom 0.152: v71.37,14.48 70.87,14.48 70.48,14.86 67.94,14.86 67.82,14.86 66.55,14.86 v62.36,19.05
  pour Top: 82.17,10.03 82.17,6.22 85.85,6.22 85.85,10.03
SO1
  Top 0.152: IC2.15 56.54,16.66 60.83,20.95 60.83,25.91 62.1,27.18 62.99,27.18 63.14,27.32 IC1.16
SO2
  Top 0.152: IC2.14 56.68,16.16 61.21,20.7 61.21,25.65 62.23,26.67 63.12,26.67 63.64,27.19 IC1.17
SO3
  Top 0.152: IC2.13 56.81,15.66 61.72,20.57 61.72,25.65 62.36,26.29 63.25,26.29 64.14,27.18 IC1.18
STS1  (1 unrouted)
STS2  (1 unrouted)
STS3  (1 unrouted)
TCK  (2 unrouted)
TDI  (2 unrouted)
TDO  (2 unrouted)
TMS  (2 unrouted)
UART_RX  (via drill 0.2)
  Top 0.152: IC2.43 39.75,18.16 v41.4,16.51 | v43.18,4.7 44.7,4.7 45.49,3.91 IC3.5
  Route15 0.152: v41.4,16.51 41.4,6.48 v43.18,4.7
UART_TX  (via drill 0.2)
  Top 0.152: IC2.42 40.26,18.66 v40.89,18.03 | v41.27,4.7 42.89,3.08 IC3.1
  Route15 0.152: v40.89,18.03 40.89,5.08 v41.27,4.7
VCC  (31 unrouted)
VDD  (via drill 0.2, 4.57 pad 7.62)  (5 unrouted)
  Top 0.152: IC1.41 65.14,39.99 v65.15,40.01
  other vias: 5.08,41.91 82.04,32.13 82.68,32.13 83.31,32.13 82.04,31.5 82.68,31.5 83.31,31.5 83.31,30.86 83.31,30.23 83.31,29.59 83.31,28.96 82.68,28.96 82.04,28.96 82.04,28.32 82.68,28.32 83.31,28.32 82.04,48.64 82.68,48.64 83.31,48.64 82.04,48.01 82.68,48.01 83.31,48.01 83.31,47.37 83.31,46.74 83.31,46.1 83.31,45.47 82.68,45.47 82.04,45.47 82.04,44.83 82.68,44.83 83.31,44.83 82.04,15.62 82.68,15.62 83.31,15.62 82.04,14.99 82.68,14.99 83.31,14.99 83.31,14.35 83.31,13.72 83.31,13.08 83.31,12.45 82.68,12.45 82.04,12.45 82.04,11.81 82.68,11.81 83.31,11.81 58.17,44.58 58.17,45.21 58.17,45.85 58.17,46.48 58.8,46.48 59.44,46.48 70.23,45.21 70.87,45.21 71.5,45.21 72.14,45.21 72.77,45.21 73.41,45.21 73.91,44.7 73.91,44.07 73.91,43.43
  pour Top (no thermals): 81.66,32.51 88.52,32.51 88.52,27.94 81.66,27.94
  pour Top (no thermals): 81.66,49.02 88.52,49.02 88.52,44.45 81.66,44.45
  pour Top (no thermals): 81.79,16 88.52,16 88.52,11.43 81.79,11.43
  pour Bottom (no thermals): 0,37.21 70.61,37.21 72.26,37.21 75.31,34.16 75.31,0 91.95,0 91.95,50.8 0,50.8
  pour Top: 57.78,44.2 59.82,44.2 59.82,46.86 57.78,46.86
  pour Top: 69.98,43.05 74.3,43.05 74.3,45.59 69.85,45.59 69.85,43.05